# EAGLE design pulse (EAGLE 6.6.0)
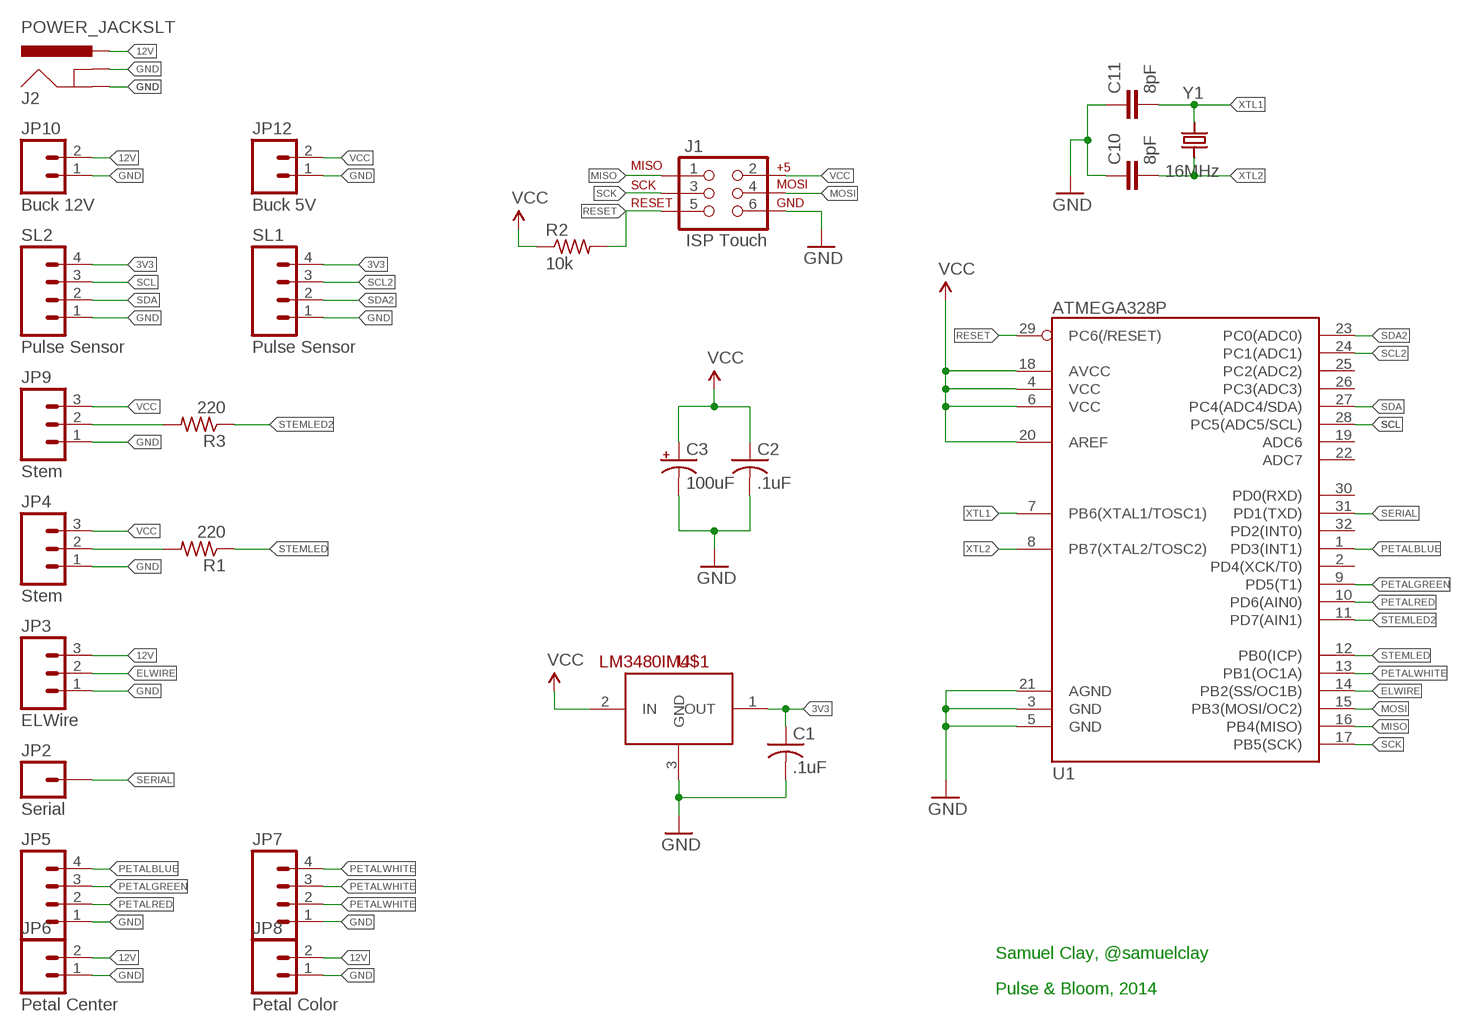
[diagram p0: schematic, sheet 1]

## Parts
C1  .1uF  C-USC0805  [C0805]
C2  .1uF  C-USC0805  [C0805]
C3  100uF  10UF-16V-10%(TANT)  [EIA3216]
C10  8pF  CAP0805  [0805]
C11  8pF  CAP0805  [0805]
J1  ISP Touch  ISPTOUCH_HEADER  [AVX_9188_6-WAY_MATING_GUIDE]
J2  POWER_JACKSLT  [POWER_JACK_SLOT]
JP2  Serial  M01PTH  [1X01]
JP3  ELWire  M03POLAR_LOCK  [MOLEX-1X3_LOCK]
JP4  Stem  M03POLAR_LOCK  [MOLEX-1X3_LOCK]
JP5  M04POLAR_LOCK  [MOLEX-1X4_LOCK]
JP6  Petal Center  M023.5MM_LOCK  [SCREWTERMINAL-3.5MM-2_LOCK]
JP7  M04POLAR  [MOLEX-1X4]
JP8  Petal Color  M023.5MM_LOCK  [SCREWTERMINAL-3.5MM-2_LOCK]
JP9  Stem  M03POLAR_LOCK  [MOLEX-1X3_LOCK]
JP10  Buck 12V  M023.5MM_LOCK  [SCREWTERMINAL-3.5MM-2_LOCK]
JP12  Buck 5V  M023.5MM_LOCK  [SCREWTERMINAL-3.5MM-2_LOCK]
R1  220  R-US_R0805  [R0805]
R2  10k  R-US_R0805  [R0805]
R3  220  R-US_R0805  [R0805]
SL1  Pulse Sensor  M04POLAR_LOCK  [MOLEX-1X4_LOCK]
SL2  Pulse Sensor  M04POLAR_LOCK  [MOLEX-1X4_LOCK]
U1  ATMEGA328P  ATMEGA328_SMT  [TQFP32-08]
U$1  LM3480IM4  [SOT23-3]
Y1  16MHz  CRYSTAL5X3.2  [NX5032GA]

## Nets
3V3: C1.1 SL1.4 SL2.4 U$1.1(OUT)
12V: J2.PWR JP3.3 JP6.2 JP8.2 JP10.2
ELWIRE: JP3.2 U1.14(PB2(SS/OC1B))
GND: C1.2 C2.2 C3.C(-) C10.1 C11.1 J1.6 J2.GND@1(GNDBREAK) J2.GND@2(GND) JP3.1 JP4.1 JP5.1 JP6.1 JP7.1 JP8.1 JP9.1 JP10.1 JP12.1 SL1.1 SL2.1 U1.3(GND) U1.5(GND) U1.21(AGND) U$1.3(GND)
MISO: J1.1 U1.16(PB4(MISO))
MOSI: J1.4 U1.15(PB3(MOSI/OC2))
N$1: JP9.2 R3.2
N$7: JP4.2 R1.2
PETALBLUE: JP5.4 U1.1(PD3(INT1))
PETALGREEN: JP5.3 U1.9(PD5(T1))
PETALRED: JP5.2 U1.10(PD6(AIN0))
PETALWHITE: JP7.2 JP7.3 JP7.4 U1.13(PB1(OC1A))
RESET: J1.5 R2.2 U1.29(PC6(/RESET))
SCK: J1.3 U1.17(PB5(SCK))
SCL: SL2.3 U1.28(PC5(ADC5/SCL))
SCL2: SL1.3 U1.24(PC1(ADC1))
SDA: SL2.2 U1.27(PC4(ADC4/SDA))
SDA2: SL1.2 U1.23(PC0(ADC0))
SERIAL: JP2.1 U1.31(PD1(TXD))
STEMLED: R1.1 U1.12(PB0(ICP))
STEMLED2: R3.1 U1.11(PD7(AIN1))
VCC: C2.1 C3.A(+) J1.2 JP4.3 JP9.3 JP12.2 R2.1 U1.4(VCC) U1.6(VCC) U1.18(AVCC) U1.20(AREF) U$1.2(IN)
XTL1: C11.2 U1.7(PB6(XTAL1/TOSC1)) Y1.P$2
XTL2: C10.2 U1.8(PB7(XTAL2/TOSC2)) Y1.P$1
Unconnected: U1.2(PD4(XCK/T0)) U1.19(ADC6) U1.22(ADC7) U1.25(PC2(ADC2)) U1.26(PC3(ADC3)) U1.30(PD0(RXD)) U1.32(PD2(INT0))

## Notes on the sheet
- Samuel Clay, @samuelclay
- Pulse & Bloom, 2014

## Library data of the parts
C1 C2 = adafruit:C-US: CAPACITOR, American symbol
C3 = SparkFun-Capacitors:10UF-16V-10%(TANT): CAP-00811 1206/EIA-3216 Tantalum capacitor; PROD_ID: CAP-00811; VALUE: 10uF
C10 C11 = SparkFun-Passives:CAP: Capacitor Standard 0603 ceramic capacitor, and 0.1" leaded capacitor.
J1 = remote:ISPTOUCH: ISPtouch for AVR Microcontrollers This 6-pin ISP connector for AVR programming does not require any part on the PCB, but an adapter for a common 6-pin programmer. http://daniel-spilker.com/blog/2011/04/25/isptouch-for-avr-microcontrollers/
J2 = SparkFun-Connectors:POWER_JACK: Power Jack This is the standard 5.5mm barrel jack for power. The PTH is the most common, proven, reliable, footprint. The Slot footprint only works if the mill layer is transmitted to the PCB fab house so be warned. Mating wall wart : TOL-00298 (and others); PROD_ID: PRT-00119
JP2 = SparkFun-Connectors:M01: Header 1 Standard 1-pin 0.1" header. Use with straight break away headers (SKU : PRT-00116), right angle break away headers (PRT-00553), swiss pins (PRT-00743), machine pins (PRT-00117), and female headers (PRT-00115).
JP3 JP4 JP9 = SparkFun-Connectors:M03: Header 3 Standard 3-pin 0.1" header. Use with straight break away headers (SKU : PRT-00116), right angle break away headers (PRT-00553), swiss pins (PRT-00743), machine pins (PRT-00117), and female headers (PRT-00115). Molex polarized connector foot print use with SKU : PRT-08232 with associated crimp pins and housings.
JP5 JP7 SL1 SL2 = SparkFun-Connectors:M04: Header 4 Standard 4-pin 0.1" header. Use with straight break away headers (SKU : PRT-00116), right angle break away headers (PRT-00553), swiss pins (PRT-00743), machine pins (PRT-00117), and female headers (PRT-00115). Molex polarized connector foot print use with SKU : PRT-08231 with associated crimp pins and housings. 1MM SMD Version SKU: PRT-10208
JP6 JP8 JP10 JP12 = SparkFun-Connectors:M02: Standard 2-pin 0.1" header. Use with - straight break away headers ( PRT-00116) - right angle break away headers (PRT-00553) - swiss pins (PRT-00743) - machine pins (PRT-00117) - female headers (PRT-00115) Molex polarized connector foot print use with: PRT-08233 with associated crimp pins and housings. 2.54_SCREWTERM for use with PRT-10571. 3.5mm Screw Terminal footprints for PRT-08084 5mm Screw Terminal footprints for use with PRT-08433
R1 R3 = resistor:R-US_: RESISTOR, American symbol
R2 = adafruit:R-US_: RESISTOR, American symbol
U1 = SparkFun-DigitalIC:ATMEGA328_SMT: 32-Pin Atmega328 part Commonly used on Arduino compatible boards Available in QFP and QFN packages TQFP is IC-09069 QFN is non-stock; PROD_ID: IC-09069
U$1 = SparkFun-PowerIC:LM3480IM4: Small package linear regulator
Y1 = remote:CRYSTAL: Crystals HC49UP - Surface Mount Crystal 4.0MHz 18pF +/-30ppm Surface Mount Crystal [Digikey: 535-9857-1-ND] 12.0 MHz Surface Mount Crystal [Digikey: 535-9869-6-ND] 25.0 MHz Surface Mount Crystal [Digikey: 535-9078-1-ND] 3.2 x 2.5mm - MEMs SMT Crystal 12.0 MHz 8pF 15ppm 3.2 x 2.5mm Crystal [Digikey: 644-1047-1-ND] 16.0 MHz 8pF 15ppm 3.2 x 2.5mm Crystal [Digikey: 644-1049-1-ND] 16.0 MHz 10pF 10ppm 3.2 x 2.5mm Crystal [Digikey: 644-1100-1-ND] 27.12 MHz 18pF 30ppm 3.2 x 2.5mm Crystal [Digikey: 887-1424-1-ND] 4.9 x 1.8mm - MEMs SMT Crystal 32.768 KHz 12.5pF 20ppm 4.9 x 1.8mm Crystal [Digikey: SE2415CT-ND] Cylinder 32.768KHz Cylinder Crystal

## Board
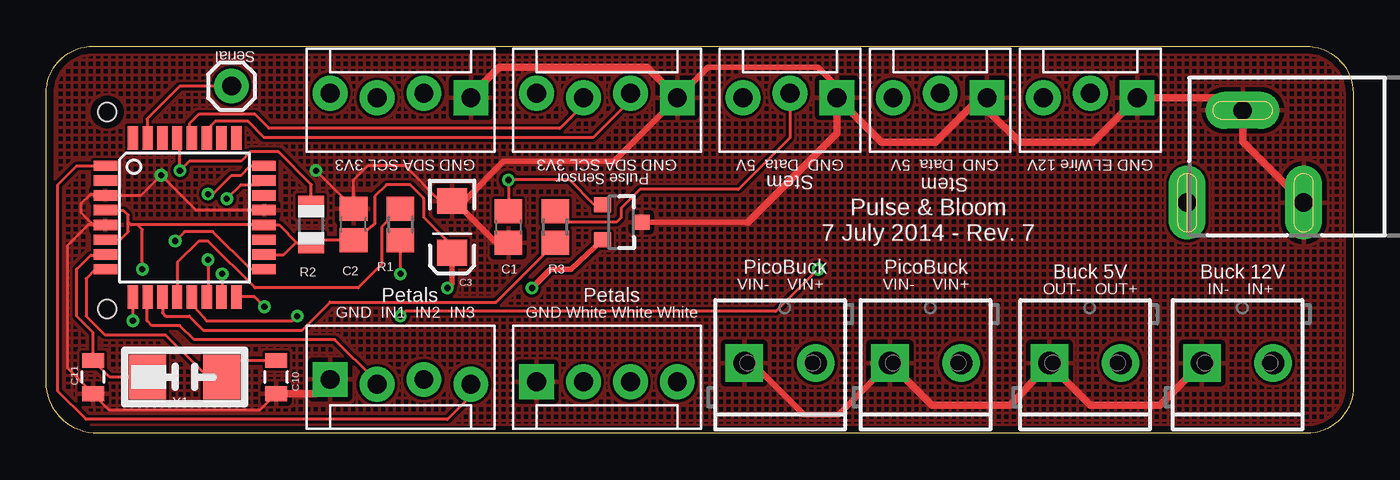
[diagram p1: board, top side]
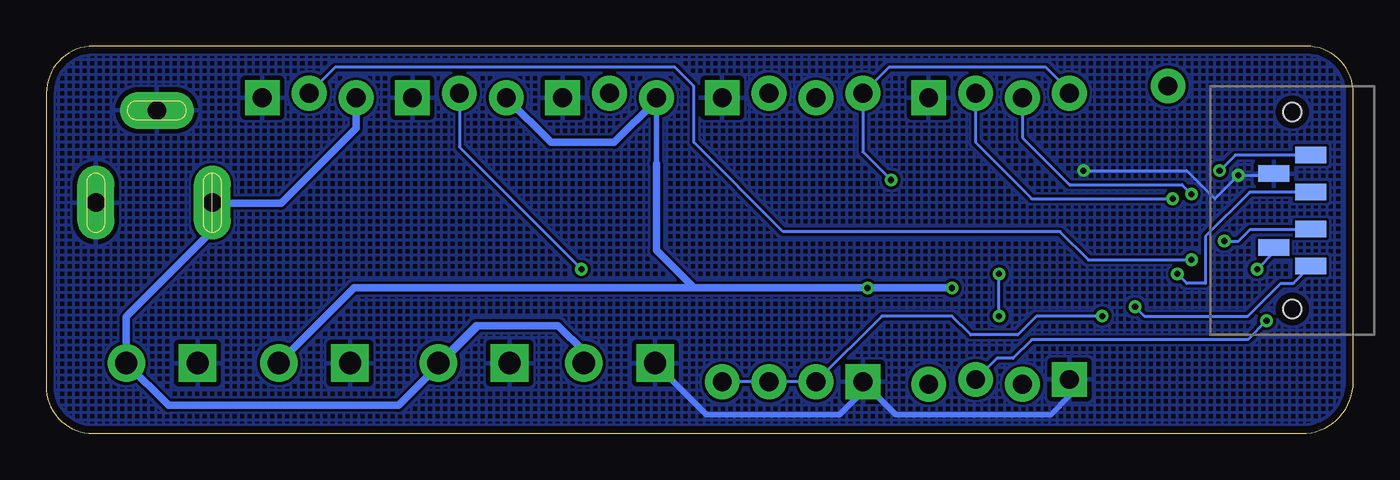
[diagram p2: board, bottom side, seen from below]

Size 70.75 x 20.96 mm. Coordinates in mm from the lower left corner, seen from the top.
Outline: 70.74,18.41 70.74,2.79 arc-90 68.45,0 2.79,0 arc-90 0,2.79 0,18.41 arc-90 2.54,20.96 68.2,20.96 arc-90 70.74,18.41
Copper layers (1*16): Top 0.0356mm / dielectric 1.5011mm / Bottom 0.0356mm
Design rules "OSHPark": minimum track width 6mil, minimum drill 13mil, track to track 6mil, track to pad 6mil, pad to pad 6mil, via to via 6mil, smd to smd 6mil, copper to edge 15mil, drill to drill 6mil, minimum pad ring 7mil, minimum via ring 7mil, stop-mask expansion 3mil, vias tented up to drill 0mil, thermal gap 10mil

### Footprints (pad centres in the part's own frame; a part is rotated, then mirrored left to right if it is on the bottom)
C0805 = smd 1.3 x 1.5: 1 -0.85,0; 2 0.85,0
EIA3216 = smd 1.4 x 1.6: A 1.4,0; C -1.4,0
0805 = smd 0.8 x 1.2: 1 -0.9,0; 2 0.9,0
AVX_9188_6-WAY_MATING_GUIDE = smd 0.9 x 1.7: 1 -3,-1; 2 -2,1; 3 -1,-1; 4 1,-1; 5 3,-1; 6 2,1 | hole 1: -5.334,0; 5.334,0
POWER_JACK_SLOT = drill 1 pad 2 long: GND@1 2.58,7.5; GND@2 7.58,10.8; PWR 2.58,13.8
1X01 = drill 1.016 pad 1.88: 1 0,0
MOLEX-1X3_LOCK = drill 1.016 pad 1.88 square: 1 0,0.127 | drill 1.016 pad 1.88: 2 2.54,-0.127; 3 5.08,0.127
MOLEX-1X4_LOCK = drill 1.016 pad 1.88 square: 1 0,0.127 | drill 1.016 pad 1.88: 2 2.54,-0.127; 3 5.08,0.127; 4 7.62,-0.127
SCREWTERMINAL-3.5MM-2_LOCK = drill 1.2 pad 2.032 square: 1 -0.178,0 | drill 1.2 pad 2.032: 2 3.678,0
MOLEX-1X4 = drill 1.016 pad 1.88 square: 1 0,0 | drill 1.016 pad 1.88: 2 2.54,0; 3 5.08,0; 4 7.62,0
R0805 = smd 1.3 x 1.5: 1 -0.85,0; 2 0.85,0
R0805' = smd 1.1 x 1.4: 1 -1,0; 2 1,0
TQFP32-08 = smd 1.27 x 0.559: 1 -4.293,2.8; 2 -4.293,2; 3 -4.293,1.2; 4 -4.293,0.4; 5 -4.293,-0.4; 6 -4.293,-1.2; 7 -4.293,-2; 8 -4.293,-2.8; 17 4.293,-2.8; 18 4.293,-2; 19 4.293,-1.2; 20 4.293,-0.4; 21 4.293,0.4; 22 4.293,1.2; 23 4.293,2; 24 4.293,2.8 | smd 0.559 x 1.27: 9 -2.8,-4.293; 10 -2,-4.293; 11 -1.2,-4.293; 12 -0.4,-4.293; 13 0.4,-4.293; 14 1.2,-4.293; 15 2,-4.293; 16 2.8,-4.293; 25 2.8,4.293; 26 2,4.293; 27 1.2,4.293; 28 0.4,4.293; 29 -0.4,4.293; 30 -1.2,4.293; 31 -2,4.293; 32 -2.8,4.293
SOT23-3 = smd 0.8 x 0.9: 1 -0.95,-1; 2 0.95,-1; 3 0,1.1
NX5032GA = smd 2 x 2.4: P$1 -2,0; P$2 2,0

### Placement (x,y rotation side)
C1  25.02,11.18 270 top
C2  16.64,11.3 90 top
C3  21.97,11.18 270 top
C10  12.45,3.05 90 top
C11  2.54,3.05 90 top
J1  3.3,12.07 90 bottom
J2  75.56,9.91 90 top
JP2  10.03,18.8 270 top
JP3  59.05,18.29 180 top
JP4  50.93,18.29 180 top
JP5  15.37,2.79 0 top
JP6  45.85,3.81 0 top
JP7  26.54,2.79 0 top
JP8  37.97,3.81 0 top
JP9  42.8,18.29 180 top
JP10  62.74,3.81 0 top
JP12  54.48,3.81 0 top
R1  19.18,11.3 270 top
R2  10k  [R0805']  14.35,11.3 90 top
R3  27.56,11.18 90 top
SL1  22.99,18.29 180 top
SL2  34.16,18.29 180 top
U1  7.49,11.68 0 top
U$1  31.11,11.43 270 top
Y1  7.49,3.05 180 top

### Tracks (layer width: path | path; a pad name or v marks a point on that pad's centre or on a via)
3V3  (via drill 0.33)
  Top 0.152: C1.1 v25.02,13.72 28.32,13.72 29.66,12.38 U$1.1
  Bottom 0.152: v25.02,13.72 26.54,15.24 SL2.4 25.15,19.81 16.64,19.81 15.37,18.54 SL1.4
12V
  Bottom 0.406: JP8.2 41.65,4.44 43.05,5.84 47.49,5.84 | 47.49,5.84 JP6.2 | 47.49,5.84 47.49,5.72 51.69,1.52 64.13,1.52 JP10.2 66.42,6.31 61.77,10.96 J2.PWR 61.73,12.45 58.04,12.45 53.98,16.51 JP3.3
ELWIRE  (via drill 0.33)
  Top 0.152: v8.76,9.4 8.76,7.46 U1.14
  Bottom 0.152: v8.76,9.4 14.35,9.4 15.88,10.92 30.86,10.92 35.69,15.75 35.69,18.8 36.7,19.81 55.12,19.81 JP3.2
GND  (via drill 0.33)
  Top 0.152: C11.1 2.54,1.9 2.41,1.78 | U1.5 2.56,11.28 | 2.56,11.28 1.91,11.94 1.91,12.45 2.41,12.95 3.13,12.95 U1.3 5.14,12.88 v6.22,13.97 8.11,12.08 U1.21 | 2.56,11.28 2.27,11.28 1.14,10.16 1.14,3.54 C11.1 | C10.1 11.56,1.27 3.42,1.27 C11.1 | C3.C 21.33,12.58 19.43,14.48 17.4,14.48 16.64,13.72 16.64,12.19 | C2.2 16.64,12.19 | 16.64,12.19 v14.61,14.22
  Top 0.305: JP8.1 38.23,3.81 41.02,1.02 42.88,1.02 JP6.1 | U$1.3 37.97,11.43 | JP9.1 42.8,18.8 41.78,19.81 35.81,19.81 SL2.1 30.73,14.73 24.76,14.73 22.61,12.58 | C3.C 22.61,12.58 | 22.61,12.58 22.61,12.06 24.26,10.41 24.93,10.41 C1.2
  Top 0.406: 37.97,11.43 42.8,16.26 JP9.1 45.21,15.75 48.13,15.75 50.55,18.16 JP4.1 50.93,17.53 52.71,15.75 56.64,15.75 JP3.1 64.09,18.16 J2.GND@2 64.77,15.79 J2.GND@1 | SL1.1 22.99,18.29 24.51,19.81 32.51,19.81 SL2.1 | JP6.1 47.96,1.52 52.2,1.52 JP12.1 54.3,3.73 56.52,1.52 60.27,1.52 JP10.1 | C10.1 14.59,2.15 JP5.1
  Bottom 0.152: J1.6 4.4,13.97 v6.22,13.97 7.49,12.7 9.02,14.22 v14.61,14.22
  Bottom 0.305: JP8.1 35,1.02 27.81,1.02 26.54,2.29 JP7.1 24.76,1.02 16.38,1.02 15.37,2.03 JP5.1
  pour Top (hatched): -1.4,-0.38 -1.4,21.59 71.75,21.59 71.75,-0.38
  pour Bottom (hatched): -0.64,-1.02 -0.64,22.35 70.99,22.35 70.99,-1.02
MISO  (via drill 0.33)
  Top 0.152: 10.52,7.39 U1.16 11.28,7.39 v11.81,6.86
  Bottom 0.152: v11.81,6.86 11.3,6.35 5.71,6.35 3.94,8.13 3.24,8.13 J1.1
MOSI  (via drill 0.33)
  Top 0.152: v9.53,8.64 9.53,7.42 U1.15
  Bottom 0.152: J1.4 5.6,13.07 8,10.67 8,8.13 9.02,8.13 v9.53,8.64
N$1
  Top 0.152: R3.2 28.15,11.43 30.86,11.43 31.11,11.68 31.11,12.19 32.13,13.21 37.47,13.21 40.26,16 JP9.2
N$7  (via drill 0.33)
  Top 0.152: v41.78,8.89 39.5,6.6 19.43,6.6 v19.18,6.35 | v19.18,8.64 R1.2
  Bottom 0.152: JP4.2 48.39,15.49 v41.78,8.89 | v19.18,6.35 v19.18,8.64
PETALBLUE
  Top 0.152: U1.1 3.19,14.48 1.65,14.48 0.64,13.46 0.64,2.29 2.16,0.76 21.72,0.76 22.99,2.03 JP5.4
PETALGREEN  (via drill 0.33)
  Top 0.152: v4.7,6.1 U1.9
  Bottom 0.152: v4.7,6.1 5.71,5.08 17.4,5.08 18.41,4.06 19.3,4.06 JP5.3
PETALRED
  Top 0.152: U1.10 5.46,7.36 5.46,6.1 5.71,5.84 7.24,5.84 8,5.08 15.62,5.08 17.78,2.92 17.78,2.79 JP5.2
PETALWHITE  (via drill 0.33)
  Top 0.152: U1.13 7.89,6.97 8,6.86 8.68,6.1 13.34,6.1 v13.59,6.35
  Bottom 0.152: v13.59,6.35 17.14,6.35 18.16,5.33 20.7,5.33 21.72,6.35 25.53,6.35 JP7.2 JP7.3 JP7.4
RESET  (via drill 0.33)
  Top 0.152: U1.29 7.24,15.83 v7.24,14.22 7.75,14.73 10.54,14.73 11.05,15.24 12.57,15.24 14.35,13.46 R2.2
  Bottom 0.152: J1.5 6.4,15.07 v7.24,14.22
SCK  (via drill 0.33)
  Top 0.152: U1.17 11.05,8.88 9.02,10.92 7.49,10.92 v6.99,10.41
  Bottom 0.152: v6.99,10.41 6.22,10.41 5.59,11.05 2.32,11.05 J1.3
SCL
  Top 0.152: SL2.3 29.08,17.78 27.81,16.51 12.06,16.51 11.3,17.27 8.26,17.27 7.75,16.76 7.75,16.12 U1.28
SCL2  (via drill 0.33)
  Top 0.152: v8.76,12.95 9.02,12.95 10.03,13.97 10.54,13.97 11.05,14.48 U1.24
  Bottom 0.152: SL1.3 17.91,16 15.37,13.46 9.27,13.46 v8.76,12.95
SDA
  Top 0.152: SL2.2 31.62,18.03 29.59,16 11.81,16 10.92,16.89 9.14,16.89 8.76,16.51 8.76,16.05 U1.27
SDA2  (via drill 0.33)
  Top 0.152: v9.78,12.7 10.54,13.46 11.56,13.46 U1.23
  Bottom 0.152: SL1.2 20.45,15.75 17.4,12.7 v9.78,12.7
SERIAL
  Top 0.152: JP2.1 7.24,18.8 5.46,17.02 5.46,16.01 U1.31
STEMLED
  Top 0.152: R1.1 19.14,12.15 18.16,11.18 18.16,9.14 16.89,7.87 11.3,7.87 8.76,10.41 8.26,10.41 7.09,9.25 U1.12
STEMLED2
  Top 0.152: U1.11 6.29,6.53 6.48,6.35 7.75,6.35 8.51,5.59 13.84,5.59 15.37,7.11 24.34,7.11 R3.1
VCC  (via drill 0.33)
  Top 0.152: U1.6 4.01,10.48 4.45,10.92 4.45,11.43 | 4.45,11.43 4.45,11.81 4.19,12.07 3.22,12.07 U1.4 | 13.59,10.3 R2.1 14.76,10.45 C2.1 17.78,11.34 17.78,12.83 18.41,13.46 19.68,13.46 20.45,12.7 20.45,11.68 21.97,10.16 C3.A | 13.59,10.3 13.48,10.3 12.83,9.65 11.82,9.65 U1.18 | 13.59,10.3 12.61,11.28 U1.20 4.95,11.28 | 4.95,11.28 4.59,11.28 4.45,11.43 | v5.21,8.89 5.21,11.03 4.95,11.28
  Top 0.305: C3.A 21.97,8.13 v21.72,7.87 | U$1.2 28.4,8.89 27.3,8.89 v26.29,7.87
  Bottom 0.152: J1.2 4.3,9.8 v5.21,8.89
  Bottom 0.305: JP9.3 37.72,14.61
  Bottom 0.406: v21.72,7.87 v26.29,7.87 35.69,7.87 | 37.72,14.61 37.72,9.91 35.69,7.87 | JP9.3 37.72,18.03 40.01,15.75 43.43,15.75 JP4.3 | 35.69,7.87 54.1,7.87 JP12.2
XTL1
  Top 0.152: U1.7 3.17,9.65 2.41,9.65 1.65,8.89 1.65,6.35 2.54,5.46 C11.2 3.44,3.05 Y1.P$2
XTL2
  Top 0.152: U1.8 2.66,8.88 2.16,8.38 2.16,6.35 3.17,5.33 6.45,5.33 8.26,3.56 8.76,3.05 Y1.P$1 10.39,3.95 C10.2

### Text on the board
tPlace: Pulse & Bloom / 7 July 2014 - Rev. 7
tNames: GND SDA SCL 3V3 | GND SDA SCL 3V3 | GND Data 5V | GND Data 5V | GND ELWire 12V | Stem | PicoBuck | PicoBuck | VIN- VIN+ | VIN- VIN+ | OUT- OUT+ | IN- IN+ | Petals | Petals | GND IN1 IN2 IN3 | GND White White White